# EAGLE design LiIonLader_1ZelleMax800mA (EAGLE 7.1.0)
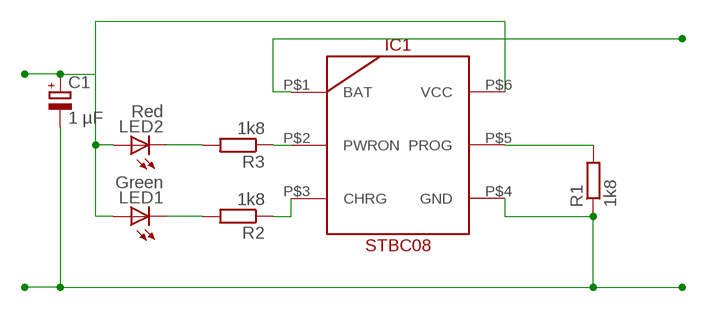
[diagram p0: schematic, sheet 1]

## Parts
C1  1 µF  CPOL-EUE1.8-4  [E1,8-4]
IC1  STBC08  [DFN6]
LED1  Green  LED3MM  [LED3MM]
LED2  Red  LED3MM  [LED3MM]
R1  1k8  R-EU_0204/5  [0204/5]
R2  1k8  R-EU_0204/5  [0204/5]
R3  1k8  R-EU_0204/5  [0204/5]

## Nets
BAT: IC1.P$1(BAT)
GND: C1.- IC1.P$4(GND) R1.1
N$2: IC1.P$3(CHRG) R2.1
N$5: LED1.K(C) R2.2
N$6: LED2.K(C) R3.2
PROG: IC1.P$5(PROG) R1.2
PWRON: IC1.P$2(PWRON) R3.1
VCC: C1.+ IC1.P$6(VCC) LED1.A LED2.A

## Library data of the parts
C1 = rcl:CPOL-EU: POLARIZED CAPACITOR, European symbol
IC1 = Own_misc:STBC08; INPUT: 4.25 - 6.5 V; MAXCURRENT: 800 mA; UBATT: 4.2 V
LED1 LED2 = led:LED: LED OSRAM: - CHIPLED LG R971, LG N971, LY N971, LG Q971, LY Q971, LO R971, LY R971 LH N974, LH R974 LS Q976, LO Q976, LY Q976 LO Q996 - Hyper CHIPLED LW Q18S LB Q993, LB Q99A, LB R99A - SideLED LS A670, LO A670, LY A670, LG A670, LP A670 LB A673, LV A673, LT A673, LW A673 LH A674 LY A675 LS A676, LA A676, LO A676, LY A676, LW A676 LS A679, LY A679, LG A679 - Hyper Micro SIDELED® LS Y876, LA Y876, LO Y876, LY Y876 LT Y87S - SmartLED LW L88C, LW L88S LB L89C, LB L89S, LG L890 LS L89K, LO L89K, LY L89K LS L896, LA L896, LO L896, LY L896 - TOPLED LS T670, LO T670, LY T670, LG T670, LP T670 LSG T670, LSP T670, LSY T670, LOP T670, LYG T670 LG T671, LOG T671, LSG T671 LB T673, LV T673, LT T673, LW T673 LH T674 LS T676, LA T676, LO T676, LY T676, LB T676, LH T676, LSB T676, LW T676 LB T67C, LV T67C, LT T67C, LS T67K, LO T67K, LY T67K, LW E67C LS E67B, LA E67B, LO E67B, LY E67B, LB E67C, LV E67C, LT E67C LW T67C LS T679, LY T679, LG T679 LS T770, LO T770, LY T770, LG T770, LP T770 LB T773, LV T773, LT T773, LW T773 LH T774 LS E675, LA E675, LY E675, LS T675 LS T776, LA T776, LO T776, LY T776, LB T776 LHGB T686 LT T68C, LB T68C - Hyper Mini TOPLED® LB M676 - Mini TOPLED Santana® LG M470 LS M47K, LO M47K, LY M47K Source: http://www.osram.convergy.de LUXEON: - LUMILED® LXK2-PW12-R00, LXK2-PW12-S00, LXK2-PW14-U00, LXK2-PW14-V00 LXK2-PM12-R00, LXK2-PM12-S00, LXK2-PM14-U00 LXK2-PE12-Q00, LXK2-PE12-R00, LXK2-PE12-S00, LXK2-PE14-T00, LXK2-PE14-U00 LXK2-PB12-K00, LXK2-PB12-L00, LXK2-PB12-M00, LXK2-PB14-N00, LXK2-PB14-P00, LXK2-PB14-Q00 LXK2-PR12-L00, LXK2-PR12-M00, LXK2-PR14-Q00, LXK2-PR14-R00 LXK2-PD12-Q00, LXK2-PD12-R00, LXK2-PD12-S00 LXK2-PH12-R00, LXK2-PH12-S00 LXK2-PL12-P00, LXK2-PL12-Q00, LXK2-PL12-R00 Source: www.luxeon.com KINGBRIGHT: KA-3528ASYC Source: www.kingbright.com
R1-R3 = rcl:R-EU_: RESISTOR, European symbol

## Board
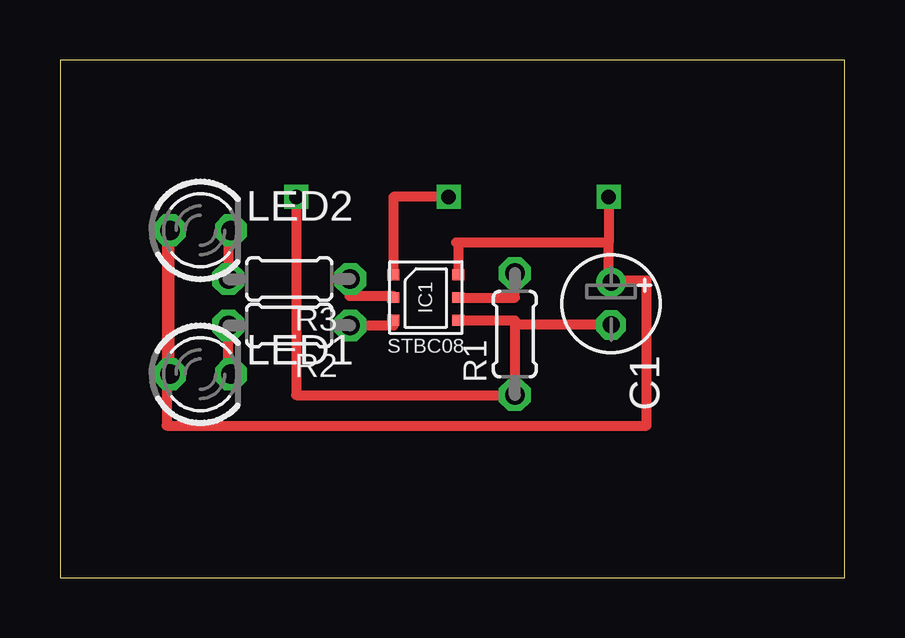
[diagram p1: board, top side]
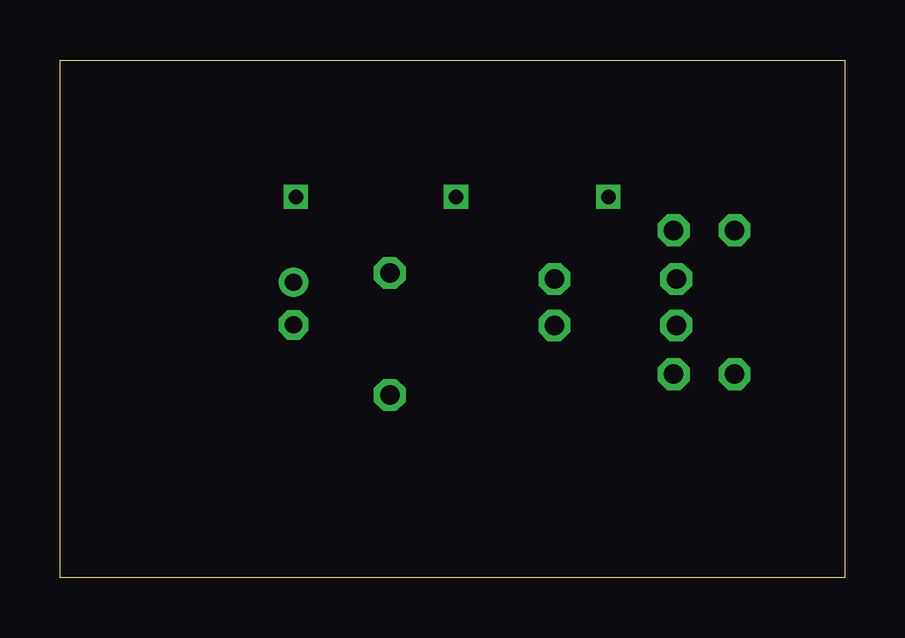
[diagram p2: board, bottom side, seen from below]

Size 32.69 x 21.58 mm. Coordinates in mm from the lower left corner, seen from the top.
Outline: 0,0 32.69,0 32.69,21.58 0,21.58 0,0
Copper layers (1*16): Top 0.035mm / dielectric 1.5mm / Bottom 0.035mm
Design rules "default": minimum track width 10mil, minimum drill 24mil, track to track 8mil, track to pad 8mil, pad to pad 8mil, via to via 8mil, smd to smd 8mil, copper to edge 40mil, drill to drill 8mil, minimum pad ring 10mil, minimum via ring 8mil, stop-mask expansion 4mil, vias tented up to drill 0mil, thermal gap 10mil

### Footprints (pad centres in the part's own frame; a part is rotated, then mirrored left to right if it is on the bottom)
E1,8-4 = drill 0.711 pad 1.168: + -0.889,0 | drill 0.711 pad 1.168 octagon: - 0.889,0
DFN6 = smd 0.5 x 0.45: P$1 -1.35,0.95; P$2 -1.35,0; P$3 -1.35,-0.95; P$4 1.35,-0.95; P$5 1.35,0; P$6 1.35,0.95
LED3MM = drill 0.813 octagon: A -1.27,0; K 1.27,0
0204/5 = drill 0.813 octagon: 1 -2.54,0; 2 2.54,0

### Placement (x,y rotation side)
C1  22.96,11.43 270 top
IC1  15.24,11.68 0 top
LED1  5.85,8.49 0 top
LED2  5.85,14.49 0 top
R1  18.95,10.16 90 top
R2  9.55,10.52 180 top
R3  9.55,12.45 180 top

### Tracks (layer width: path | path; a pad name or v marks a point on that pad's centre or on a via)
BAT  (via drill 0.6)
  Top 0.406: v16.19,15.88 13.89,15.88 IC1.P$1
GND  (via drill 0.6)
  Top 0.406: IC1.P$4 18.95,10.73 18.95,10.54 | 18.95,10.54 R1.1 9.84,7.62 v9.84,15.88 | C1.- 18.95,10.54
N$2
  Top 0.406: R2.1 13.89,10.52 IC1.P$3
N$5
  Top 0.406: LED1.K 7.01,8.49 R2.2
N$6
  Top 0.406: LED2.K 7.01,14.49 R3.2
  Bottom 0.406: R3.2 7.12,12.45
PROG
  Top 0.406: IC1.P$5 18.95,11.68 R1.2
PWRON
  Top 0.406: R3.1 12.06,12.45 12.06,11.75 13.89,11.75 IC1.P$2
VCC  (via drill 0.6)
  Top 0.406: LED1.A LED2.A 4.45,14.49 4.45,6.35 24.45,6.35 24.45,12.38 22.96,12.38 C1.+ 22.86,12.32 22.86,13.97 | 22.86,13.97 16.59,13.97 | 16.51,13.97 16.59,13.97 | 16.59,13.97 IC1.P$6 | v22.86,15.88 22.86,13.97